# Altium schematic sheet Adafruit HUZZAH32 ESP32 Feather.SchDoc
size 282 x 197 mm; COMPANY: ADAFRUIT INDUSTRIES; DRAWN: KTOWN; REV: B; Origin: Eagle
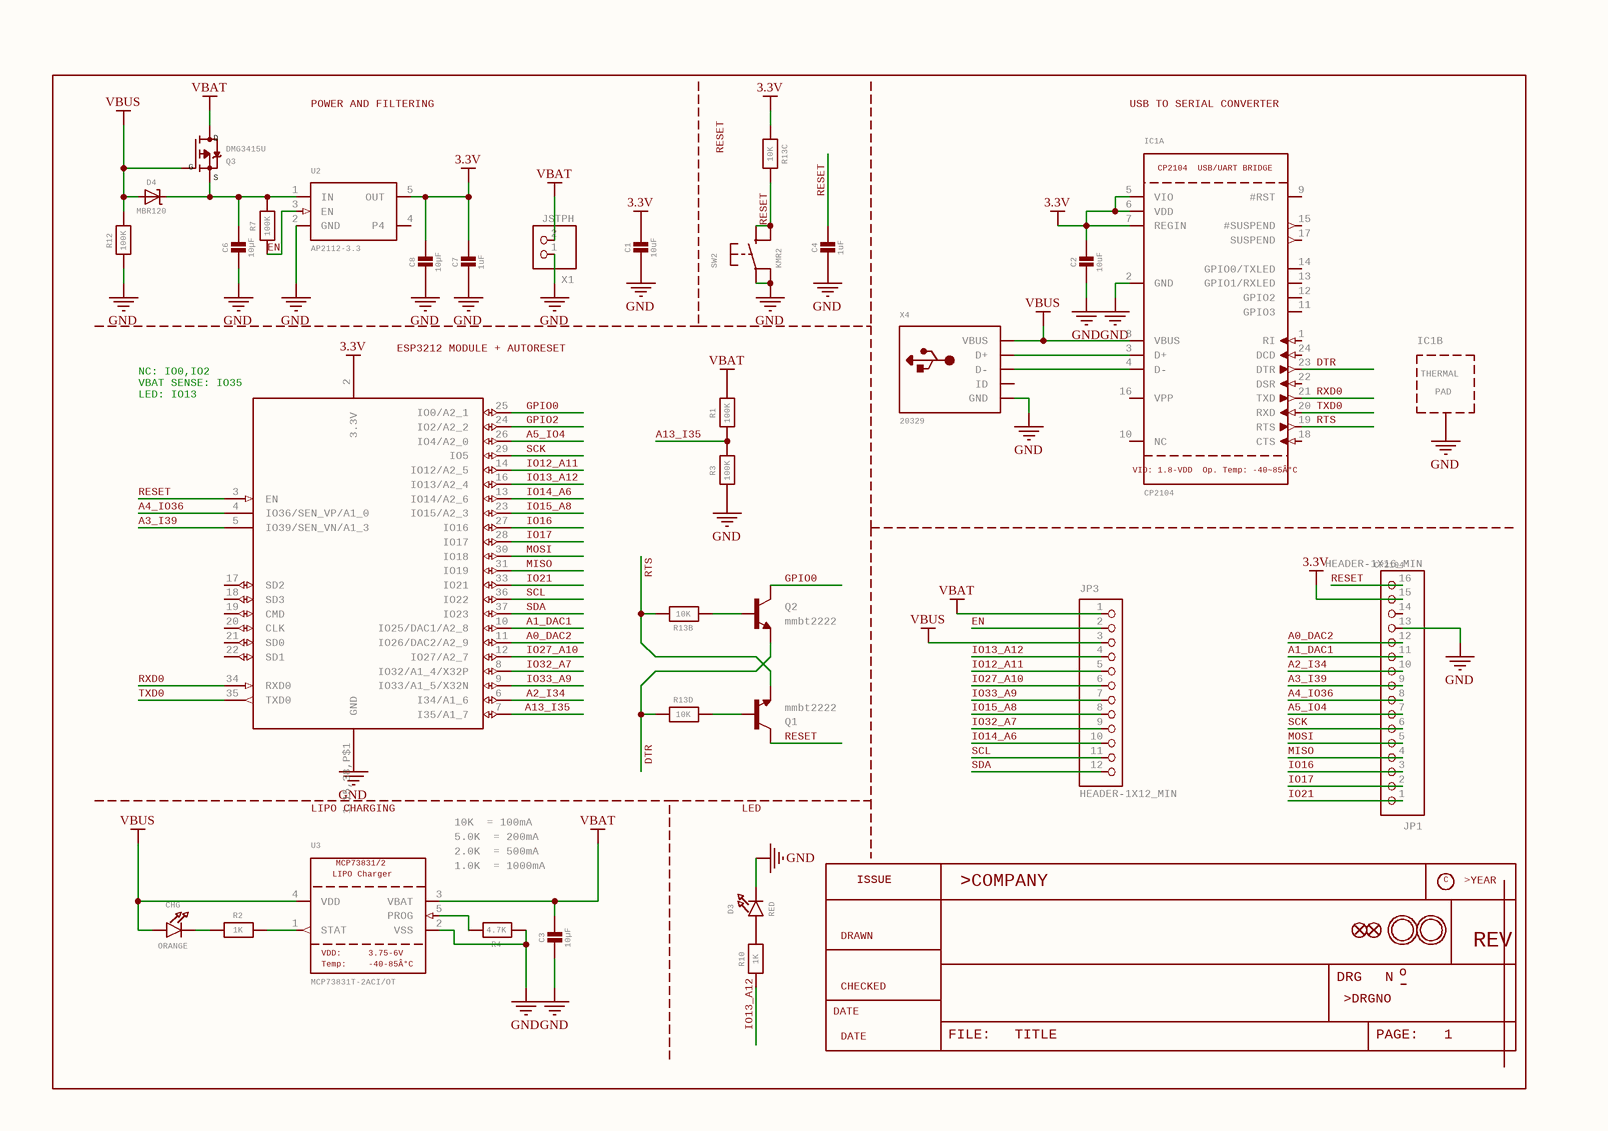
[diagram p0: Adafruit HUZZAH32 ESP32 Feather.SchDoc]

## Parts
C1  10uF  [0805-NO]
C2  10uF  [0805-NO]
C3  10µF  [0805-NO]
C4  1uF  [0603-NO]
C6  10µF  [0805-NO]
C7  1uF  [0603-NO]
C8  10µF  [0805-NO]
CHG  ORANGE  [CHIPLED_0805_NOOUTLINE]
D3  RED  [CHIPLED_0805_NOOUTLINE]
D4  MBR120  [SOD-123]
FRAME1  FRAME_A4  (value not drawn)  (parts A,B of 2)
IC1  CP2104  CP2104
USB/UARTBRIDGE: CP2104 / USB/UART BRIDGE  VIO:1.8-VDD
Op.Temp:-40~85Â°C: VIO: 1.8-VDD / Op. Temp: -40~85Â°C  [QFN24_4MM_SMSC]  (parts A,B of 2)
JP1  HEADER-1X16_MIN  [1X16_ROUND_MIN]
JP3  HEADER-1X12_MIN  [1X12_ROUND_MIN]
Q1  mmbt2222  [SOT23-3]
Q2  mmbt2222  [SOT23-3]
Q3  DMG3415U  [SOT23-R]
R1  100K  [0603-NO]
R2  1K  [0603-NO]
R3  100K  [0603-NO]
R4  4.7K  [0603-NO]
R7  100K  [0603-NO]
R10  1K  [0603-NO]
R12  100K  [0603-NO]
R13  10K  [RESPACK_4X0603]  (parts B,C,D of 4)
SW2  KMR2  [BTN_KMR2_4.6X2.8]
U2  AP2112-3.3  [SOT23-5]
U3  MCP73831T-2ACI/OT  LIPOCharger: LIPO Charger  Temp: Temp:  VDD: VDD:  [SOT23-5]
U$31  MOUNTINGHOLE2.5  [MOUNTINGHOLE_2.5_PLATED]  (value not drawn)
U$32  MOUNTINGHOLE2.5  [MOUNTINGHOLE_2.5_PLATED]  (value not drawn)
U$34  FIDUCIAL_1MM  [FIDUCIAL_1MM]  (value not drawn)
U$35  FIDUCIAL_1MM  [FIDUCIAL_1MM]  (value not drawn)
X1  JSTPH  [JSTPH2]
X2  ESP32_WROOM32_SKINNY  [WROOM32_SKINNY]  (value not drawn)
X4  20329  [4UCONN_20329_V2]

## Nets
3.3V: C1.1 C2.1 C7.1 C8.1 IC1.5(VIO) IC1.6(VDD) IC1.7(REGIN) JP1.15 R13.3 U2.5(OUT) X2.2(3.3V)
GND: C1.2 C2.2 C3.2 C4.2 C6.2 C7.2 C8.2 D3.C IC1.2(GND) IC1.THERM(TP) JP1.13 R3.1 R4.1 R12.1 SW2.A(P) SW2.A'(P1) U2.2(GND) U3.2(VSS) X1.1 X2.1,15,38,P$1(GND) X4.BASE@1,BASE@2,GND,SPRT@1,SPRT@2,SPRT@3,SPRT@4(GND)
VBAT: C3.1 JP3.1 Q3.3(D) R1.2 U3.3(VBAT) X1.2
VBUS: CHG.A D4.A IC1.8(VBUS) JP3.3 Q3.1(G) R12.2 U3.4(VDD) X4.VBUS
A0_DAC2: JP1.12 X2.11(IO26/DAC2/A2_9)
A1_DAC1: JP1.11 X2.10(IO25/DAC1/A2_8)
A2_I34: JP1.10 X2.6(I34/A1_6)
A3_I39: JP1.9 X2.5(IO39/SEN_VN/A1_3)
A4_IO36: JP1.8 X2.4(IO36/SEN_VP/A1_0)
A5_IO4: JP1.7 X2.26(IO4/A2_0)
A13_I35: R1.1 R3.2 X2.7(I35/A1_7)
DTR: IC1.23(DTR) Q2.2(E) R13.4
EN: JP3.2 R7.1 U2.3(EN)
GPIO0: Q2.3(C) X2.25(IO0/A2_1)
GPIO2: X2.24(IO2/A2_2)
IO12_A11: JP3.5 X2.14(IO12/A2_5)
IO13_A12: JP3.4 R10.1 X2.16(IO13/A2_4)
IO14_A6: JP3.10 X2.13(IO14/A2_6)
IO15_A8: JP3.8 X2.23(IO15/A2_3)
IO16: JP1.3 X2.27(IO16)
IO17: JP1.2 X2.28(IO17)
IO21: JP1.1 X2.33(IO21)
IO27_A10: JP3.6 X2.12(IO27/A2_7)
IO32_A7: JP3.9 X2.8(IO32/A1_4/X32P)
IO33_A9: JP3.7 X2.9(IO33/A1_5/X32N)
MISO: JP1.4 X2.31(IO19)
MOSI: JP1.5 X2.30(IO18)
RESET: C4.1 JP1.16 Q1.3(C) R13.6 SW2.B(S) SW2.B'(S1) X2.3(EN)
RTS: IC1.19(RTS) Q1.2(E) R13.7
RXD0: IC1.21(TXD) X2.34(RXD0)
SCK: JP1.6 X2.29(IO5)
SCL: JP3.11 X2.36(IO22)
SDA: JP3.12 X2.37(IO23)
TXD0: IC1.20(RXD) X2.35(TXD0)
NetC6_1: C6.1 D4.C Q3.2(S) R7.2 U2.1(IN)
NetCHG_C: CHG.C R2.1
NetD3_A: D3.A R10.2
NetIC1_3: IC1.3(D+) X4.D+
NetIC1_4: IC1.4(D-) X4.D-
NetQ1_1: Q1.1(B) R13.5
NetQ2_1: Q2.1(B) R13.2
NetR2_2: R2.2 U3.1(STAT)
NetR4_2: R4.2 U3.5(PROG)

Not connected (* = marked no-connect by the designer): IC1 1(RI) 9(#RST) 10(NC) 11(GPIO3) 12(GPIO2) 13(GPIO1/RXLED) 14(GPIO0/TXLED) 15(#SUSPEND) 16(VPP) 17(SUSPEND) 18(CTS) 22(DSR) 24(DCD); JP1 14; U2 4(P4); X2 17(SD2) 18(SD3) 19(CMD) 20(CLK) 21(SD0) 22(SD1); X4 ID

## Notes on the sheet
- POWER AND FILTERING
- (near R13) RESET
- USB TO SERIAL CONVERTER
- (near X2) ESP3212 MODULE + AUTORESET
- (near X2) NC: IO0,IO2
  VBAT SENSE: IO35
  LED: IO13
- LIPO CHARGING
- 10K  = 100mA
- 5.0K  = 200mA
- 2.0K  = 500mA
- 1.0K  = 1000mA
- LED

## Library data of the parts
C1-C3 C6 C8 = CAP_CERAMIC0805-NOOUTLINE: Ceramic Capacitors   For new designs, use the packages preceded by an '_' character since they are more reliable:   The following footprints should be used on most boards: _0402 - Standard footprint for regular board layouts  _0603 - Standard footprint for regular board layouts  _0805 - Standard footprint for regular board layouts  _1206 - Standard footprint for regular board layouts       For extremely tight-pitch boards where space is at a premium, the following 'micro-pitch' footprints can be used (smaller pads, no silkscreen outline, etc.): _0402MP - Micro-pitch footprint for very dense/compact boards  _0603MP - Micro-pitch footprint for very dense/compact boards  _0805MP - Micro-pitch footprint for very dense/compact boards  _1206MP - Micro-pitch footprint for very dense/compact boards; GateName_1: G$1; SymbolName_1: CAPACITOR; DeviceName: 0805-NOOUTLINE; LibraryName: microbuilder; DeviceSetName: CAP_CERAMIC
C4 C7 = CAP_CERAMIC0603_NO: Ceramic Capacitors   For new designs, use the packages preceded by an '_' character since they are more reliable:   The following footprints should be used on most boards: _0402 - Standard footprint for regular board layouts  _0603 - Standard footprint for regular board layouts  _0805 - Standard footprint for regular board layouts  _1206 - Standard footprint for regular board layouts       For extremely tight-pitch boards where space is at a premium, the following 'micro-pitch' footprints can be used (smaller pads, no silkscreen outline, etc.): _0402MP - Micro-pitch footprint for very dense/compact boards  _0603MP - Micro-pitch footprint for very dense/compact boards  _0805MP - Micro-pitch footprint for very dense/compact boards  _1206MP - Micro-pitch footprint for very dense/compact boards; GateName_1: G$1; SymbolName_1: CAPACITOR; DeviceName: 0603_NO; LibraryName: microbuilder; DeviceSetName: CAP_CERAMIC
CHG D3 = LED0805_NOOUTLINE: LED0603 - 0603 Surface Mount Package    2mA: Green LED - Low Power (3.9mcd, 2ma, 1.7Vf) - Digikey: 475-2709-2-ND  Orange LED - Low Power (9.8mcd, 2ma, 1.8Vf) - Digikey: 475-1194-2-ND  Red LED - Low Power (5mcd, 2ma, 1.8Vf) - Digikey: 475-1195-2-ND  Yellow LED - Low Power (7mcd, 2ma, 1.8Vf) - Digikey: 475-1196-2-ND       5mA: Blue LED - Low Power (17mcd, 5ma, 2.9Vf) - Digikey: LNJ937W8CRACT-ND    0805 - 0805 Surface Mount Package    2mA: Red LED (8.8mcd, 2mA, 1.8Vf, Clear) - Low Power [Digikey: 475-2510-1-ND]  Green LED (5mcd, 2mA, 1.8Vf, Clear) - Low Power [Digikey: 475-2730-1-ND]  Yellow LED (11.3mcd, 2mA, 1.8Vf, Clear) - Low Power [Digikey: 475-2555-1-ND]       20mA: Red LED (104mcd, 20mA, Diffused) - LS R976 [Digikey: 475-1278-6-ND]  Red LED (12mcd, 20mA, 2.0Vf, Clear) - APT2012EC [Digikey: 754-1128-1-ND]  Green LED (15mcd, 20mA, 2.2Vf, Clear) - APT2012GC [Digikey: 754-1131-1-ND]  Orange LED (160mcd, 20mA, 2.1Vf, Clear) - APT2012SECK [Digikey: 754-1130-1-ND]     1206 - 1206 Surface Mount Package  Green LED (26mcd, 20mA, Diffused) - LG N971  [Digikey: 475-1407-6-ND]  Red LED (15mcd, 20mA, Diffused) - LH N974 [Digikey: 475-1416-6-ND]     Cree - Cree High-Power Surface Mount LEDs  XPEBWT-L1-0000-00D50 - White 111lm 350mA 2.9Vf 6200K 110Â°  XTEAWT-00-0000-00000LEE3 - White 114lm 350mA 2.85Vf 5000K 115Â°     Everlight - Everlight 45-21 Series Surface Mount LEDs  45-21/QK2C-B2832AC2CB2/2T - Warm White 2000mcd 20mA 3.25Vf 3050K 120Â°  45-21/LK2C-B38452C4CB2/2T - Nuetral White 2000mcd 20mA 3.25Vf 4150K 120Â°  45-21/LK2C-B50634C6CB2/2T - Cold White 2200mcd 20mA 3.25Vf 5650K 120Â°     PLCC2 Reverse Mount LS T77K-J1L2-1-0-2-R18-Z - Red 11.25mcd 2mA 1.8Vf 630nm 120Â°  LO T77K-L1M2-24-Z - Orange 19.6mcd 2mA 1.8Vf 606nm 120Â°  LY T77K-K2M1-26-Z - Yellow 15.7mcd 2mA 1.8Vf 587nm 120Â°; GateName_1: G$1; SymbolName_1: LED; DeviceName: 0805_NOOUTLINE; LibraryName: microbuilder; DeviceSetName: LED
D4 = DIODE-SCHOTTKYSOD-123: GateName_1: G$1; SymbolName_1: DIODE-SCHOTTKY; DeviceName: SOD-123; LibraryName: microbuilder; DeviceSetName: DIODE-SCHOTTKY
FRAME1 = FRAME_A4: FRAME   DIN A4, landscape with location and doc. field; GateName_1: G$1; GateName_2: G$3; SymbolName_2: FRAME_DOCFIELD; SymbolName_1: FRAME_A4; LibraryName: microbuilder; DeviceSetName: FRAME_A4
IC1 = CP2104: CP2104 - USB to UART Bridge    VDD Output: 3.45V; GateName_1: G$1; GateName_2: G$2; SymbolName_2: THERMAL-SLUG; SymbolName_1: CP2104; LibraryName: microbuilder; DeviceSetName: CP2104
JP1 = HEADER-1X16_MIN: PIN HEADER; GateName_1: A; SymbolName_1: PINHD16; DeviceName: _MIN; LibraryName: microbuilder; DeviceSetName: HEADER-1X16
JP3 = HEADER-1X12_MIN: GateName_1: G$1; SymbolName_1: PINHD12; DeviceName: _MIN; LibraryName: microbuilder; DeviceSetName: HEADER-1X12
Q1 Q2 = TRANSISTOR_NPNSOT23-3: Transistor NPNBJT configuration in SOT23 package. MMBT2222 is the common NPN we use. Double check BCE configuration again layout.; GateName_1: G$1; SymbolName_1: NPN; DeviceName: SOT23-3; LibraryName: SparkFun; DeviceSetName: TRANSISTOR_NPN
Q3 = MOSFET-P: P-Channel Mosfet   LEGEND   VDS: Voltage Drain-Source ID: Drain Current RDS(ON): Drain-Source On-State Resistance VGS(TH): Gate-Source Threshold Voltage CISS: Drain-Source Input Capacitance    SOT-23   Name	VDS	ID	RDS(ON)	VGS(TH)	CISS	Order Number	   IRLML5103	30V	760mA	600 mOhm	--	75pF @ 25V	Digikey: IRLML5103PBFCT-ND	   IRLML6401	12V	4.3A	50 mOhm	950mV @ 250ÂµA	830pF @ 10V	Digikey: IRLML6401PBFTR-ND	   NTR0202PL	20V	400mA	800 mOhm	2.3V @ 250uA	70pF @ 5V	Digikey: NTR0202PLT1GOSTR-ND	   NTR4101PT1G	20V	1.8A	85 mOhm	1.2V @ 250uA	675pF @ 10V	Digikey: NTR4101PT1GOSCT-ND	   DMP2004K	20V	600mA	900 mOhm	1V @ 250uA	175pF @ 16V	Digikey: DMP2004KDICT-ND	   PMV65XP	20V	3.9A	76 mOhm	950mV @ 1mA	725pF @ 20V	Digikey: 568-2358-2-ND	   							   							TO-252   Name	VDS	ID	RDS(ON)	VGS(TH)	CISS	Order Number	   AOD417	30V	25A	34 mOhm	3V @ 250ÂµA	920pF @ 15V	Digikey: 785-1106-2-ND	PowerPak   Name	VDS	ID	RDS(ON)	VGS(TH)	CISS	Order Number	   AON7401	30V	12A	14 mOhm	3V @ 250ÂµA	2600pF @ 15V	Digikey: 785-1302-1-ND; GateName_1: G$1; SymbolName_1: MOSFET-P; LibraryName: microbuilder; DeviceSetName: MOSFET-P; D: D; S: S; G: G
R1-R4 R7 R10 R12 = RESISTOR_0603_NOOUT: Resistors   For new designs, use the packages preceded by an '_' character since they are more reliable:   The following footprints should be used on most boards: _0402 - Standard footprint for regular board layouts  _0603 - Standard footprint for regular board layouts  _0805 - Standard footprint for regular board layouts  _1206 - Standard footprint for regular board layouts       For extremely tight-pitch boards where space is at a premium, the following 'micro-pitch' footprints can be used (smaller pads, no silkscreen outline, etc.): _0402MP - Micro-pitch footprint for very dense/compact boards  _0603MP - Micro-pitch footprint for very dense/compact boards  _0805MP - Micro-pitch footprint for very dense/compact boards  _1206MP - Micro-pitch footprint for very dense/compact boards; GateName_1: G$1; SymbolName_1: RESISTOR; DeviceName: _0603_NOOUT; LibraryName: microbuilder; DeviceSetName: RESISTOR
R13 = RESISTOR_4PACK: Resistor Packs (4 resistors)   4 x 0603 10K 1/16W - Digikey: YC164J-10KCT-ND; GateName_1: G$1; GateName_2: G$2; GateName_3: G$3; GateName_4: G$4; SymbolName_1: RESISTOR; SymbolName_2: RESISTOR; SymbolName_3: RESISTOR; SymbolName_4: RESISTOR; LibraryName: microbuilder; DeviceSetName: RESISTOR_4PACK
SW2 = SWITCH_TACT_SMT4.6X2.8: SMT Tact Switches 6x6mm - Digikey: P12940SCT-ND  KMR2 (4.6x2.8mm) - Digikey: 401-1426-1-ND  EVQ-PQHB55 - Light Touch, 160GF (4.5x4.5mm) - Digikey: P8090SCT-ND  KMT0 - KMT021 NGJ LHS (etc.) IP68/Waterproof - Digikey: CKN10289CT-ND; GateName_1: G$1; SymbolName_1: BUTTON_4PIN; DeviceName: 4.6X2.8; LibraryName: microbuilder; DeviceSetName: SWITCH_TACT_SMT
U2 = VREG_SOT23-5: SOT23-5 Fixed Voltage Regulators      Part	Current Out	V Out	V In	V Dropout	Î¸JA (Â°C/W)	TJ (Â°C)	Digikey Part No.	     ADP121	  150mA	  3.3V	  3.4-5.5V	  0.09V @ 150mA	  --	  --	  ADP121-AUJZ33R7CT-ND	     ADP121	  150mA	  3.0V	  3.1-5.5V	  0.09V @ 150mA	  --	  --	  ADP121-AUJZ30R7CT-ND	     ADP122	  300mA	  3.3V	  3.4-5.5V	  0.085V @ 300mA	  --	  --	  ADP122AUJZ-3.3-R7CT-ND	     ADP1712	  300mA	  3.3V	  3.5-5.5V	  0.17V @ 300mA	  --	  --	  ADP1712AUJZ-3.3-R7TR-ND	     AP7311 (Low Cost)	  150mA	  3.3V	  3.5-6V	  0.15V @ 150mA	  --	  --	  AP7311-33WG-7DICT-ND	     LD39015M18R	  150mA	  1.8V	  1.9V-5.5V	  0.08V @ 100mA	  --	  --	  497-6977-1-ND	     LP2985A-33DBVR	  150mA	  3.3V	  3.3-16V	  0.28V @ 150mA	  206	  150	  296-18479-1-ND	     MCP1824T-3302E/OT	  300mA	  3.3V	  3.5V-6V	  0.2V @ 300mA	  --	  --	  MCP1824T-3302E/OTCT-ND	     MIC5205-2.5YM5 TR	  150mA	  2.5V	  2.7-16V	  0.165V @ 150mA	  --	  --	  576-1257-2-ND	     MIC5205-3.0YM5 TR	  150mA	  3.0V	  3.2V-16V	  0.165V @ 150mA	  --	  --	  576-1258-2-ND	     MIC5205-3.3YM5 TR	  150mA	  3.3V	  3.5V-16V	  0.165V @ 150mA	  --	  --	  576-1259-2-ND	     TPS780330220	  150mA	  3.3V+2.2V	  3.6-5.5V	  250mV Max	  --	  --	  296-23332-1-ND	     TDA3663/N1,135	  100mA	  3.3V	  3.5-45V	  0.18V @ 50mA	  --	  --	  568-5343-1-ND	     	  	  	  	  	  	  	  	     	  	  	  	  	  	  	  	   Max operating temp can be calculated using Î¸JA, TJ (max junction temperature), and power in watts.  Set the "Maximum Ambient Temperature" until it reaches TJ ("Max Junction Temperature"), which is the absolute limit for safe use of the regulator: Heat Sink Temperature Calculator   For example, With 12V source into a 3.3V LP2985 and a 30mA load, we are dissipating (12V-3.3V) * 0.03A = 0.261W.  With a Î¸JA of 206 Â°C/W, a TJ of 150Â°C, and 261mW we can safely use the chip without a heat sink up to 75Â°C (=147.1Â°C Junction Temperature).; GateName_1: G$1; SymbolName_1: VREG_SOT23-5; LibraryName: microbuilder; DeviceSetName: VREG_SOT23-5
U3 = MCP73831/2: MCP73831/2 LIPO Charger    VDD: 3.75 - 6V  Temp -40 - 85Â°C  Programmable Charge Rate: 15-500mA       NOTE: STAT is a tri-state logic output on the MCP73831 and an open-drain output on the MCP73832.   SOT23-5 with 4.2V output and tri-state logic on STAT = MCP73831T-2ACI/OT; GateName_1: G$1; SymbolName_1: MCP73831/2; LibraryName: microbuilder; DeviceSetName: MCP73831/2; MCP73831/2: MCP73831/2; -40-85Â°C: -40-85Â°C; 3.75-6V: 3.75-6V
U$31 U$32 = MOUNTINGHOLE2.5: Mounting Hole   For #2 screws (0.086"/2.18mm width, 0.094"/2.4mm hole) use 2.5mm; GateName_1: G$1; DeviceName: 2.5; BOM: EXCLUDE; SymbolName_1: MOUNTINGHOLE; LibraryName: microbuilder; DeviceSetName: MOUNTINGHOLE
U$34 U$35 = FIDUCIAL_1MM: Fiducial Alignment Points   Various fiducial points for machine vision alignment.; GateName_1: G$1; DeviceName: _1MM; BOM: EXCLUDE; SymbolName_1: FIDUCIAL; LibraryName: microbuilder; DeviceSetName: FIDUCIAL
X1 = CON_JST_PH_2PIN: JST 2-Pin Right-Angle Connector  PH-Series - 4UConnector: 17311  SH-Series - 4UConnector: 07278; GateName_1: G$1; SymbolName_1: PINHD2; LibraryName: microbuilder; DeviceSetName: CON_JST_PH_2PIN
X2 = ESP32_WROOM32_SKINNY: GateName_1: G$1; SymbolName_1: WROOM32; DeviceName: _SKINNY; LibraryName: microbuilder; DeviceSetName: ESP32_WROOM32
X4 = USB_MICRO_20329_V2: USB ConnectorsUSBMINIB - Surface Mount Female Mini-B USB Connector    4UConnector: 06564; GateName_1: G$1; SymbolName_1: USB; DeviceName: _MICRO_20329_V2; LibraryName: microbuilder; DeviceSetName: USB